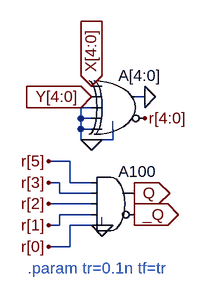
[diagram p0: schematic eq-5bit.asc]
eq-5bit.asc, the LTspice schematic file:
Version 4
SHEET 1 880 680
WIRE 176 112 160 112
WIRE 96 128 80 128
WIRE 80 144 80 128
WIRE 96 144 80 144
WIRE 80 160 80 144
WIRE 96 160 80 160
WIRE 80 176 80 160
WIRE 96 176 80 176
WIRE 128 176 128 160
WIRE 128 176 96 176
WIRE 64 208 32 208
WIRE 48 240 32 240
WIRE 64 240 64 208
WIRE 96 240 64 240
WIRE 48 256 48 240
WIRE 96 256 48 256
WIRE 96 272 32 272
WIRE 96 288 48 288
WIRE 48 304 48 288
WIRE 48 304 32 304
WIRE 96 304 64 304
WIRE 64 336 64 304
WIRE 64 336 32 336
FLAG 96 176 0
FLAG 96 96 X[4:0]
IOPIN 96 96 In
FLAG 96 112 Y[4:0]
IOPIN 96 112 In
FLAG 176 112 0
FLAG 176 144 r[4:0]
FLAG 112 304 0
FLAG 32 240 r[3]
FLAG 32 272 r[2]
FLAG 160 256 Q
IOPIN 160 256 Out
FLAG 160 288 _Q
IOPIN 160 288 Out
FLAG 32 304 r[1]
FLAG 32 336 r[0]
FLAG 32 208 r[5]
SYMBOL Digital\\xor 144 64 R0
SYMATTR InstName A[4:0]
SYMBOL Digital\\and 128 208 R0
SYMATTR InstName A100
TEXT 0 368 Left 2 ;.param tr=0.1n tf=tr

The netlist it stands for:
* eq-5bit.asc
A[4:0] X[4:0] Y[4:0] 0 0 0 r[4:0] 0 0 XOR
A100 r[5] r[3] r[2] r[1] r[0] _Q Q 0 AND
* .param tr=0.1n tf=tr
.backanno
.end